# EAGLE schematic night-light (EAGLE 9.2.2)
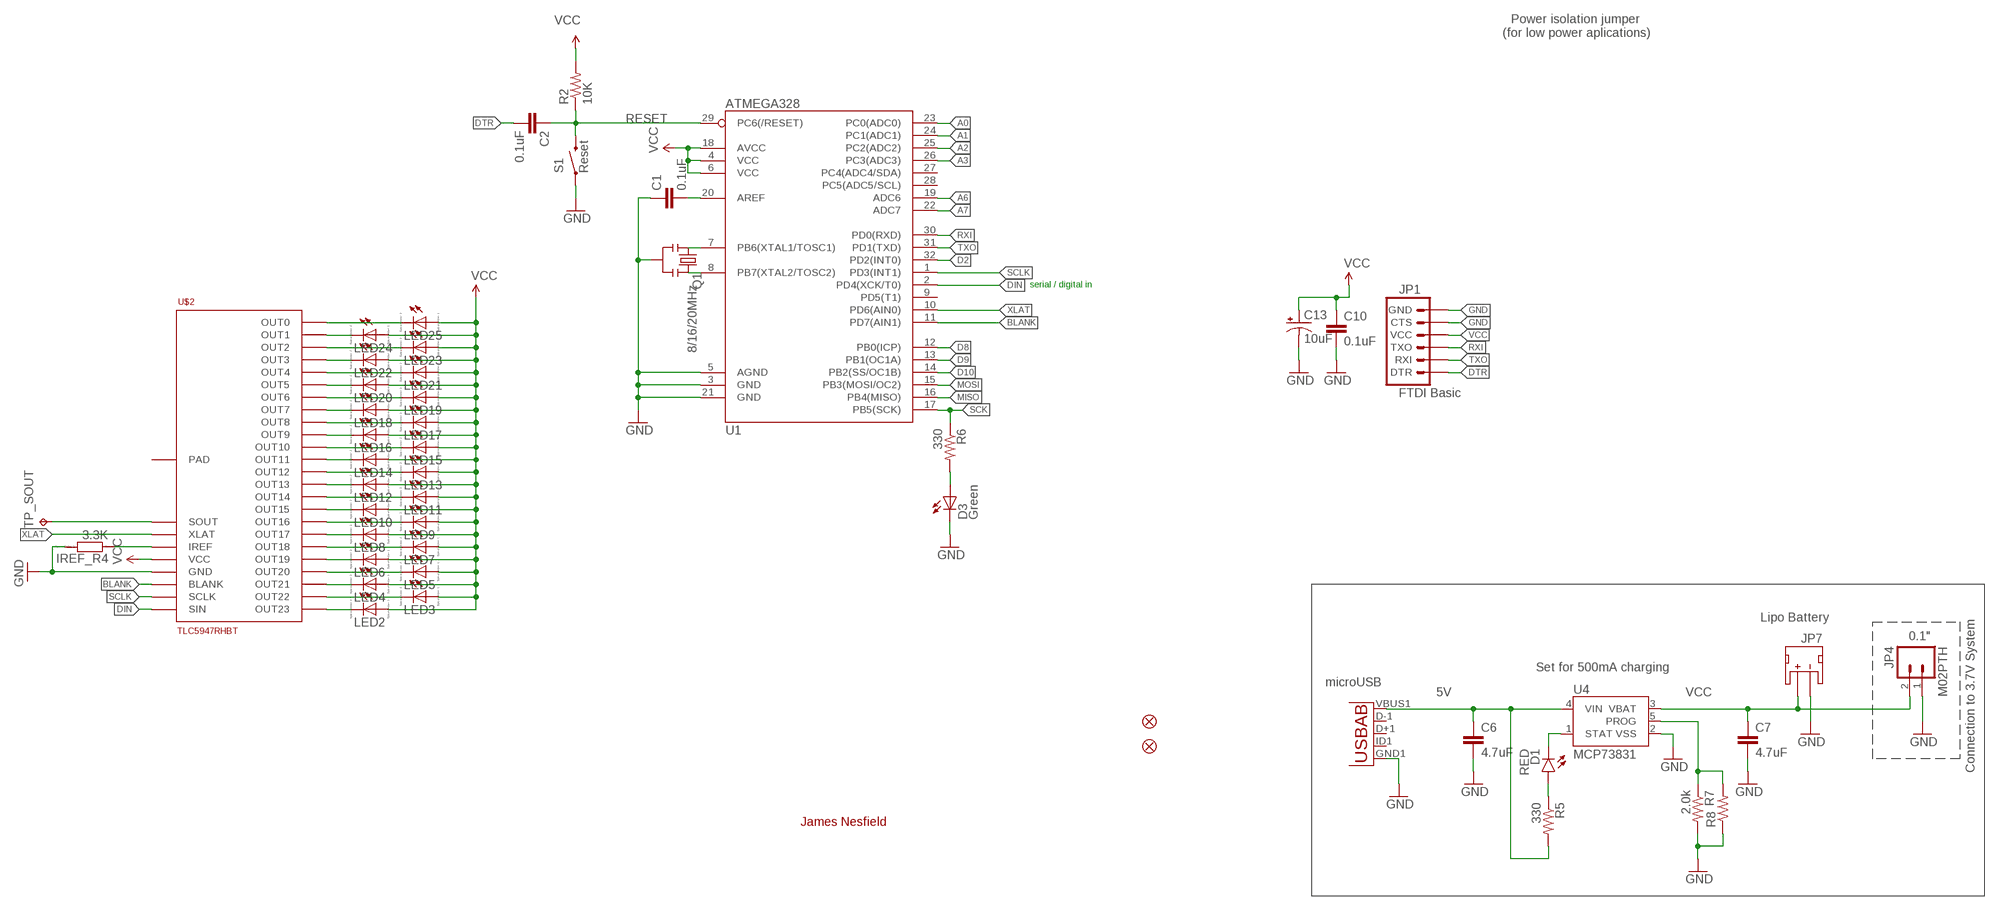
[diagram p0: schematic, sheet 1]

## Parts
C1  0.1uF  CAP0603-CAP  [0603-CAP]
C2  0.1uF  CAP0603-CAP  [0603-CAP]
C6  4.7uF  4.7UF-6.3V-10%(0603)0603  [0603-CAP]
C7  4.7uF  4.7UF-6.3V-10%(0603)0603  [0603-CAP]
C10  0.1uF  CAP0603-CAP  [0603-CAP]
C13  10uF  CAP_POL1206  [EIA3216]
D1  RED  LED-RED0603  [LED-0603]
D3  Green  LED  [0603-LED-ALT1]
IREF_R4  3.3K  RR0603  [R0603]
JP1  FTDI Basic  ARDUINO_SERIAL_PROGRAMPTH  [1X06]
JP4  M02PTH  [1X02]
JP5  FIDUCIALUFIDUCIAL  [MICRO-FIDUCIAL]
JP6  Micro USB  USB-ABCONN-11794  [USB-AB-MICRO-SMD_V03]
JP7  JST  JST_2MM_MALE  [JST-2-SMD]
JP8  FIDUCIALUFIDUCIAL  [MICRO-FIDUCIAL]
LED2  LED_E  [LED_1206]
LED3  LED_E  [LED_1206]
LED4  LED_E  [LED_1206]
LED5  LED_E  [LED_1206]
LED6  LED_E  [LED_1206]
LED7  LED_E  [LED_1206]
LED8  LED_E  [LED_1206]
LED9  LED_E  [LED_1206]
LED10  LED_E  [LED_1206]
LED11  LED_E  [LED_1206]
LED12  LED_E  [LED_1206]
LED13  LED_E  [LED_1206]
LED14  LED_E  [LED_1206]
LED15  LED_E  [LED_1206]
LED16  LED_E  [LED_1206]
LED17  LED_E  [LED_1206]
LED18  LED_E  [LED_1206]
LED19  LED_E  [LED_1206]
LED20  LED_E  [LED_1206]
LED21  LED_E  [LED_1206]
LED22  LED_E  [LED_1206]
LED23  LED_E  [LED_1206]
LED24  LED_E  [LED_1206]
LED25  LED_E  [LED_1206]
Q1  8/16/20MHz  RESONATOR1:1  [RESONATOR-SMD-1:1]
R2  10K  RESISTOR0603-RES  [0603-RES]
R5  330  330OHM1/10W1%(0603)  [0603-RES]
R6  330  RESISTOR0603-RES  [0603-RES]
R7  2.0k  2.0KOHM1/10W5%(0603)  [0603-RES]
R8  RESISTORPTH-1/4W-VERT-KIT  [AXIAL-0.1EZ]
S1  Reset  SWITCH-MOMENTARY-2SMD-ALT01  [TACTILE-SWITCH-SMD-ALT01]
TP_SOUT  TPTP20R  [TP20R]
U1  ATMEGA328  ATMEGA168  [TQFP32-08]
U4  MCP73831  [SOT23-5]
U$2  TLC5947RHBT  [QFN32]

## Nets
3.3V: LED2.A LED3.A LED4.A LED5.A LED6.A LED7.A LED8.A LED9.A LED10.A LED11.A LED12.A LED13.A LED14.A LED15.A LED16.A LED17.A LED18.A LED19.A LED20.A LED21.A LED22.A LED23.A LED24.A LED25.A U$2.28(VCC) ; supply symbol labelled VCC
5V: C6.1 JP6.VBUS1(VBUS) R5.2 U4.4(VIN)
A0: U1.23(PC0(ADC0))
A1: U1.24(PC1(ADC1))
A2: U1.25(PC2(ADC2))
A3: U1.26(PC3(ADC3))
A6: U1.19(ADC6)
A7: U1.22(ADC7)
BLANK: U1.11(PD7(AIN1)) U$2.30(BLANK)
D2: U1.32(PD2(INT0))
D8: U1.12(PB0(ICP))
D9: U1.13(PB1(OC1A))
D10: U1.14(PB2(SS/OC1B))
DIN: U1.2(PD4(XCK/T0)) U$2.32(SIN)
DTR: C2.2 JP1.1(DTR)
GND [vcc]: C1.1 C6.2 C7.2 C10.2 C13.C(-) D3.C IREF_R4.2 JP1.5(CTS) JP1.6(GND) JP4.1 JP6.GND1(GND) JP7.1(-) Q1.2 R7.2 R8.P$1 S1.1 S1.2 U1.3(GND) U1.5(AGND) U1.21(GND) U4.2(VSS) U$2.29(GND)
MISO: U1.16(PB4(MISO))
MOSI: U1.15(PB3(MOSI/OC2))
N$1: Q1.3 U1.8(PB7(XTAL2/TOSC2))
N$2: Q1.1 U1.7(PB6(XTAL1/TOSC1))
N$5: LED25.C U$2.1(OUT0)
N$6: IREF_R4.1 U$2.27(IREF)
N$7: D3.A R6.2
N$8: LED24.C U$2.2(OUT1)
N$9: TP_SOUT.TP U$2.25(SOUT)
N$10: LED23.C U$2.3(OUT2)
N$11: LED22.C U$2.4(OUT3)
N$12: LED21.C U$2.5(OUT4)
N$13: LED20.C U$2.6(OUT5)
N$14: LED19.C U$2.7(OUT6)
N$15: LED18.C U$2.8(OUT7)
N$16: LED17.C U$2.9(OUT8)
N$17: LED16.C U$2.10(OUT9)
N$18: LED15.C U$2.11(OUT10)
N$19: LED14.C U$2.12(OUT11)
N$20: LED13.C U$2.13(OUT12)
N$21: LED12.C U$2.14(OUT13)
N$22: LED11.C U$2.15(OUT14)
N$23: LED10.C U$2.16(OUT15)
N$24: LED9.C U$2.17(OUT16)
N$25: LED8.C U$2.18(OUT17)
N$26: LED7.C U$2.19(OUT18)
N$27: LED6.C U$2.20(OUT19)
N$28: LED5.C U$2.21(OUT20)
N$29: LED4.C U$2.22(OUT21)
N$30: LED3.C U$2.23(OUT22)
N$31: LED2.C U$2.24(OUT23)
N$32: C1.2 U1.20(AREF)
N$34: D1.A R5.1
PROG1: R7.1 R8.P$2 U4.5(PROG)
RESET: C2.1 R2.1 S1.3 S1.4 U1.29(PC6(/RESET))
RXI: JP1.3(TXO) U1.30(PD0(RXD))
SCK: R6.1 U1.17(PB5(SCK))
SCLK: U1.1(PD3(INT1)) U$2.31(SCLK)
STAT1: D1.C U4.1(STAT)
TXO: JP1.2(RXI) U1.31(PD1(TXD))
VCC: C7.1 C10.1 C13.A(+) JP1.4(VCC) JP4.2 JP7.2(+) R2.2 U1.4(VCC) U1.6(VCC) U1.18(AVCC) U4.3(VBAT)
XLAT: U1.10(PD6(AIN0)) U$2.26(XLAT)
Unconnected: JP6.D+1(D+) JP6.D-1(D-) JP6.ID1(USBID) JP7.NC1(PAD1) JP7.NC2(PAD2) U1.9(PD5(T1)) U1.27(PC4(ADC4/SDA)) U1.28(PC5(ADC5/SCL)) U$2.EXP(PAD)

## Notes on the sheet
- Power isolation jumper
- (for low power aplications)
- serial / digital in
- Lipo Battery
- 0.1"
- Set for 500mA charging
- microUSB
- Connection to 3.7V System
- James Nesfield

## Library data of the parts
C1 C2 C10 = SparkFun:CAP: Capacitor Standard 0603 ceramic capacitor, and 0.1" leaded capacitor.
C6 C7 = SparkFun-Capacitors:4.7UF-6.3V-10%(0603): CAP-08280; PROD_ID: CAP-08280
C13 = SparkFun:CAP_POL: Capacitor Polarized These are standard SMD and PTH capacitors. Normally 10uF, 47uF, and 100uF in electrolytic and tantalum varieties. Always verify the external diameter of the through hole cap, it varies with capacity, voltage, and manufacturer. The EIA devices should be standard.
D1 = SparkFun-LED:LED-RED: Assorted Red LEDs LilyPad 1206- DIO-09912 1206- DIO-00809 0603- DIO-00819; PROD_ID: DIO-00819
D3 = Testing:LED: LEDs Standard schematic elements and footprints for 5mm, 3mm, 1206, and 0603 sized LEDs. 5mm - Spark Fun Electronics SKU : COM-00529 (and others)
IREF_R4 = eagle-ltspice:R: RESISTOR, European symbol; SPICEMODEL: NONE; SPICEPREFIX: R
JP1 = SparkFun:ARDUINO_SERIAL_PROGRAM
JP4 = SparkFun-Connectors:M02: Standard 2-pin 0.1" header. Use with - straight break away headers ( PRT-00116) - right angle break away headers (PRT-00553) - swiss pins (PRT-00743) - machine pins (PRT-00117) - female headers (PRT-00115) Molex polarized connector foot print use with: PRT-08233 with associated crimp pins and housings. 2.54_SCREWTERM for use with PRT-10571. 3.5mm Screw Terminal footprints for PRT-08084 5mm Screw Terminal footprints for use with PRT-08432
JP5 JP8 = SparkFun:FIDUCIAL: Fiducial Alignment Points Various fiducial points for machine vision alignment.
JP6 = SparkFun-Connectors:USB-AB: This is a USB AB connector that is compatible with USB OTG. i.e. this connector can serve as a host or device; PROD_ID: CONN-11794
JP7 = SparkFun-Connectors:JST_2MM_MALE: Mates to single-cell LiPo batteries. CONN-08352; PROD_ID: CONN-08352
LED2-LED25 = eagle-ltspice:LED_E: LED Source: http://www.osram.convergy.de Source: www.luxeon.com Source: www.kingbright.com; SPICEMODEL: NONE; SPICEPREFIX: D; SPICETYPE: diode
Q1 = Testing:RESONATOR: Resonator Small SMD resonator. This is the itty bitty 10/20MHz resonators with built in caps. CSTCE10M0G55 and CSTCE20M0V53. Footprint for SMD has been used in SFE production for years, and does work okay. 1:1 is an attempt to get larger fillets on the sides so it will be easier to inspect these solders in our AOI machine. The pads have been minimized to match the actual metal under the resonator. To see this relation, it includes an image import of the bottom side of the component. Imported to scale on layer 200.
R2 R6 = SparkFun:RESISTOR: Resistor Basic schematic elements and footprints for 0603, 1206, and PTH resistors.
R5 = SparkFun-Resistors:330OHM1/10W1%(0603): RES-00818; PROD_ID: RES-00818
R7 = SparkFun-Resistors:2.0KOHM1/10W5%(0603): RES-08296; PROD_ID: RES-08296
R8 = SparkFun-Resistors:RESISTOR: Resistor Basic schematic elements and footprints for 0603, 1206, and PTH resistors.
S1 = Testing:SWITCH-MOMENTARY-2: Various NO switches- pushbuttons, reed, etc
TP_SOUT = testpad:TP: Test pad
U1 = SparkFun:ATMEGA168
U4 = SparkFun-PowerIC:MCP73831: Miniature single cell, fully integrated Li-Ion, Li-polymer charge management controller http://ww1.microchip.com/downloads/en/DeviceDoc/21984a.pdf IC-09995; PROD_ID: IC-09995
U$2 = TLC5947:TLC5947

## Net classes
0 default: width 0.203 mm
1 vcc: width 0.254 mm